# EAGLE design open-circuit (EAGLE 6.6.0)
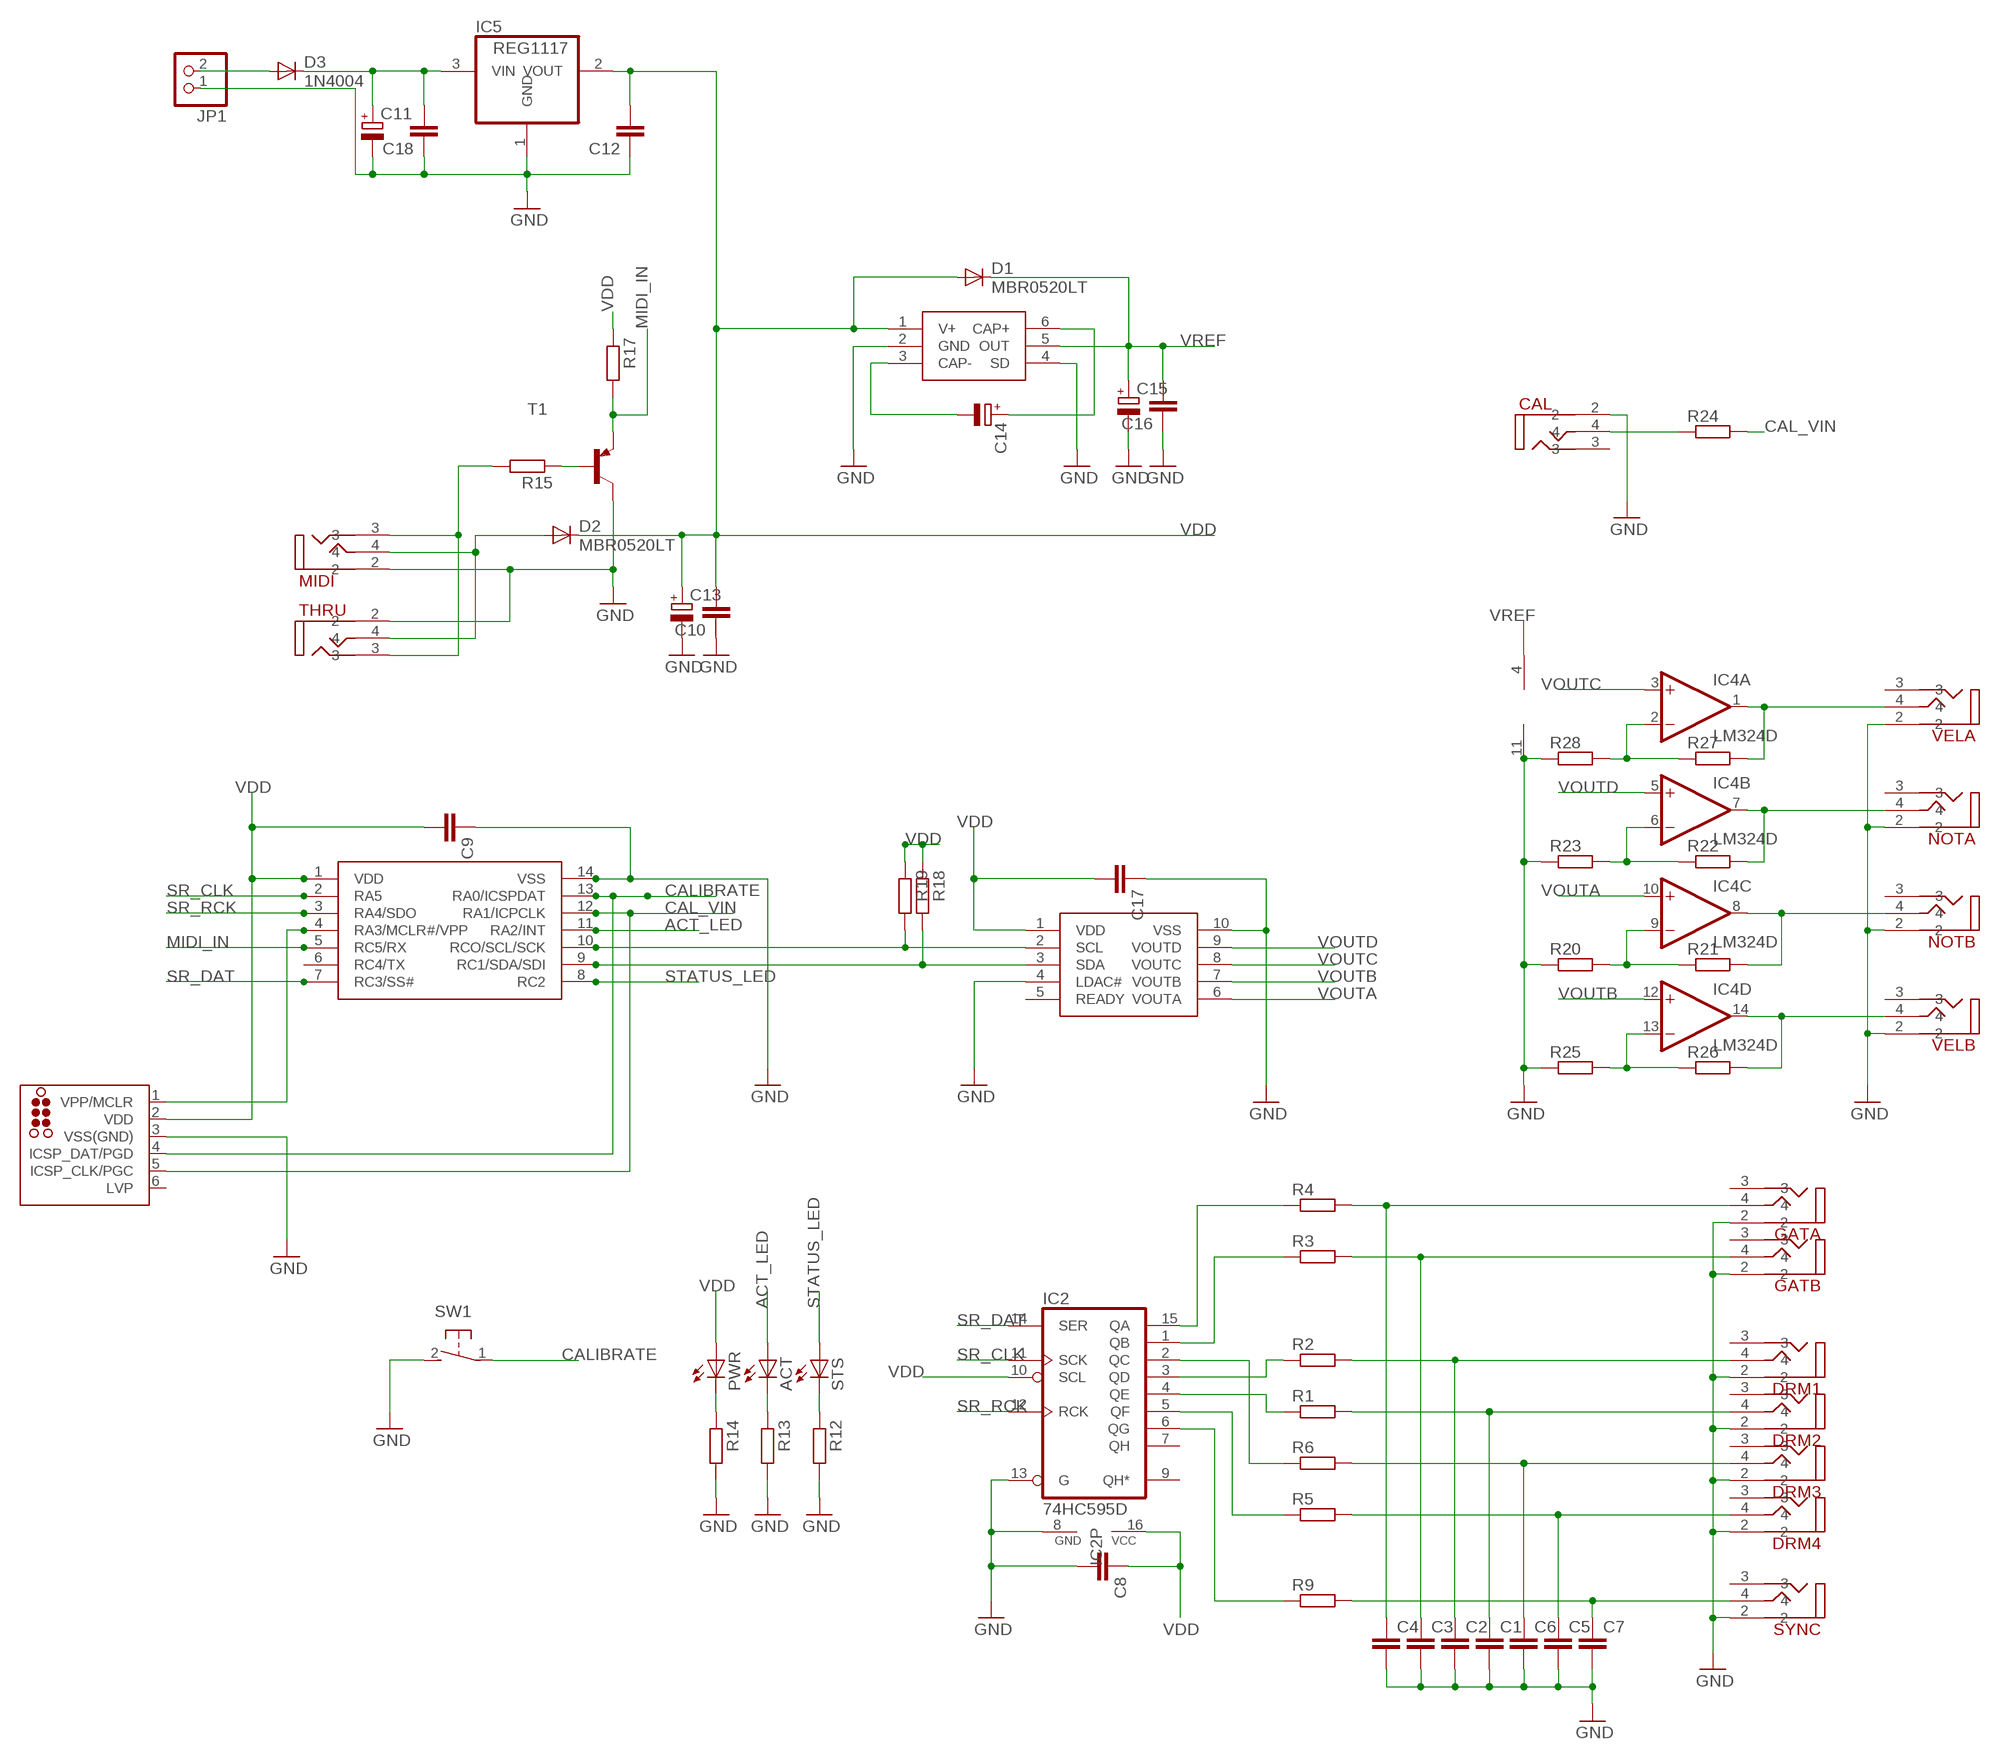
[diagram p0: schematic, sheet 1]

## Parts
ACT  LED3MM  [LED3MM]
C1  C-EUC0805  [C0805]
C2  C-EUC0805  [C0805]
C3  C-EUC0805  [C0805]
C4  C-EUC0805  [C0805]
C5  C-EUC0805  [C0805]
C6  C-EUC0805  [C0805]
C7  C-EUC0805  [C0805]
C8  C-EUC0805  [C0805]
C9  C-EUC0805  [C0805]
C10  C-EUC0805  [C0805]
C11  CPOL-EUE2.5-5  [E2,5-5]
C12  C-EUC0805  [C0805]
C13  CPOL-EUSMCA  [SMC_A]
C14  CPOL-EUSMCA  [SMC_A]
C15  CPOL-EUSMCA  [SMC_A]
C16  C-EUC0805  [C0805]
C17  C-EUC0805  [C0805]
C18  C-EUC0805  [C0805]
CAL  VERTICAL_3_5MM_SOCKET  [VERTICAL_3_5MM_SOCKET]
D1  MBR0520LT  [SOD123]
D2  MBR0520LT  [SOD123]
D3  1N4004  [DO-VERT]
DRM1  VERTICAL_3_5MM_SOCKET  [VERTICAL_3_5MM_SOCKET]
DRM2  VERTICAL_3_5MM_SOCKET  [VERTICAL_3_5MM_SOCKET]
DRM3  VERTICAL_3_5MM_SOCKET  [VERTICAL_3_5MM_SOCKET]
DRM4  VERTICAL_3_5MM_SOCKET  [VERTICAL_3_5MM_SOCKET]
GATA  VERTICAL_3_5MM_SOCKET  [VERTICAL_3_5MM_SOCKET]
GATB  VERTICAL_3_5MM_SOCKET  [VERTICAL_3_5MM_SOCKET]
IC1  PIC16F1825SO14  [SO14]
IC2  74HC595D  [SO16]
IC3  MCP4728_QUAD_DAC  [MSOP10]
IC4  LM324D  [SO14]
IC5  REG1117  [SOT223]
IC6  LM27675M5_CHARGEPUMP  [SOT23-6]
ISCP  TC2030-MCP-NL  [TC2030-MCP-NL]
JP1  PINHD-1X2  [1X02]
MIDI  VERTICAL_3_5MM_SOCKET  [VERTICAL_3_5MM_SOCKET]
NOTA  VERTICAL_3_5MM_SOCKET  [VERTICAL_3_5MM_SOCKET]
NOTB  VERTICAL_3_5MM_SOCKET  [VERTICAL_3_5MM_SOCKET]
PWR  LED3MM  [LED3MM]
R1  R-EU_R0805  [R0805]
R2  R-EU_R0805  [R0805]
R3  R-EU_R0805  [R0805]
R4  R-EU_R0805  [R0805]
R5  R-EU_R0805  [R0805]
R6  R-EU_R0805  [R0805]
R9  R-EU_R0805  [R0805]
R12  R-EU_R0805  [R0805]
R13  R-EU_R0805  [R0805]
R14  R-EU_R0805  [R0805]
R15  R-EU_R0805  [R0805]
R17  R-EU_R0805  [R0805]
R18  R-EU_R0805  [R0805]
R19  R-EU_R0805  [R0805]
R20  R-EU_R0805  [R0805]
R21  R-EU_R0805  [R0805]
R22  R-EU_R0805  [R0805]
R23  R-EU_R0805  [R0805]
R24  R-EU_R0805  [R0805]
R25  R-EU_R0805  [R0805]
R26  R-EU_R0805  [R0805]
R27  R-EU_R0805  [R0805]
R28  R-EU_R0805  [R0805]
STS  LED3MM  [LED3MM]
SW1  31-XX  [B3F-31XX]
SYNC  VERTICAL_3_5MM_SOCKET  [VERTICAL_3_5MM_SOCKET]
T1  MMBT3906LT1-PNP-SOT23-BEC  [SOT23-BEC]
THRU  VERTICAL_3_5MM_SOCKET  [VERTICAL_3_5MM_SOCKET]
VELA  VERTICAL_3_5MM_SOCKET  [VERTICAL_3_5MM_SOCKET]
VELB  VERTICAL_3_5MM_SOCKET  [VERTICAL_3_5MM_SOCKET]

## Nets
ACT_LED: ACT.A IC1.11(RA2/INT)
CAL_VIN: IC1.12(RA1/ICPCLK) ISCP.5(ICSP_CLK/PGC) R24.2
CALIBRATE: IC1.13(RA0/ICSPDAT) ISCP.4(ICSP_DAT/PGD) SW1.1(P)
GND: C1.2 C2.2 C3.2 C4.2 C5.2 C6.2 C7.2 C8.2 C9.1 C10.1 C11.- C12.1 C13.- C15.- C16.1 C17.1 C18.1 CAL.2 DRM1.2 DRM2.2 DRM3.2 DRM4.2 GATA.2 GATB.2 IC1.14(VSS) IC2.8(GND) IC2.13(G) IC3.4(LDAC#) IC3.10(VSS) IC4.11(P:V-) IC5.1(GND) IC6.2(GND) IC6.4(SD) ISCP.3(VSS(GND)) JP1.1 MIDI.2 NOTA.2 NOTB.2 R12.2 R13.2 R14.2 R20.1 R23.1 R25.1 R28.1 SW1.2(S) SYNC.2 T1.C THRU.2 VELA.2 VELB.2
MIDI_IN: IC1.5(RC5/RX) R17.2 T1.E
N$1: C4.1 GATA.4 R4.2
N$2: IC4.1(A:OUT) R27.2 VELA.4
N$3: IC4.7(B:OUT) NOTA.4 R22.2
N$4: IC4.8(C:OUT) NOTB.4 R21.2
N$5: IC4.14(D:OUT) R26.2 VELB.4
N$6: C3.1 GATB.4 R3.2
N$7: C2.1 DRM1.4 R2.2
N$8: C1.1 DRM2.4 R1.2
N$9: C6.1 DRM3.4 R6.2
N$10: C5.1 DRM4.4 R5.2
N$11: C7.1 R9.2 SYNC.4
N$12: IC2.15(QA) R4.1
N$13: IC2.1(QB) R3.1
N$14: R15.1 T1.B
N$15: IC2.4(QE) R1.1
N$16: IC2.3(QD) R2.1
N$17: IC2.5(QF) R5.1
N$18: IC2.6(QG) R9.1
N$19: C11.+ C18.2 D3.C IC5.3(VIN)
N$20: MIDI.3 R15.2 THRU.3
N$21: IC1.10(RCO/SCL/SCK) IC3.2(SCL) R19.2
N$22: IC1.9(RC1/SDA/SDI) IC3.3(SDA) R18.2
N$23: C14.- IC6.3(CAP-)
N$24: C14.+ IC6.6(CAP+)
N$25: IC4.2(A:-IN) R27.1 R28.2
N$26: IC4.6(B:-IN) R22.1 R23.2
N$27: IC4.9(C:-IN) R20.2 R21.1
N$28: IC4.13(D:-IN) R25.2 R26.1
N$33: CAL.4 R24.1
N$34: IC1.4(RA3/MCLR#/VPP) ISCP.1(VPP/MCLR)
N$35: PWR.K(C) R14.1
N$36: ACT.K(C) R13.1
N$37: R12.1 STS.K(C)
N$38: IC2.2(QC) R6.1
N$39: D2.A MIDI.4 THRU.4
N$40: D3.A JP1.2
SR_CLK: IC1.2(RA5) IC2.11(SCK)
SR_DAT: IC1.7(RC3/SS#) IC2.14(SER)
SR_RCK: IC1.3(RA4/SDO) IC2.12(RCK)
STATUS_LED: IC1.8(RC2) STS.A
VDD: C8.1 C9.2 C10.2 C12.2 C13.+ C17.2 D1.A D2.C IC1.1(VDD) IC2.10(SCL) IC2.16(VCC) IC3.1(VDD) IC5.2(VOUT) IC6.1(V+) ISCP.2(VDD) PWR.A R17.1 R18.1 R19.1
VOUTA: IC3.6(VOUTA) IC4.10(C:+IN)
VOUTB: IC3.7(VOUTB) IC4.12(D:+IN)
VOUTC: IC3.8(VOUTC) IC4.3(A:+IN)
VOUTD: IC3.9(VOUTD) IC4.5(B:+IN)
VREF: C15.+ C16.2 D1.C IC4.4(P:V+) IC6.5(OUT)
Unconnected: CAL.3 DRM1.3 DRM2.3 DRM3.3 DRM4.3 GATA.3 GATB.3 IC1.6(RC4/TX) IC2.7(QH) IC2.9(QH*) IC3.5(READY) ISCP.6(LVP) NOTA.3 NOTB.3 SYNC.3 VELA.3 VELB.3

## Library data of the parts
ACT PWR STS = led:LED: LED OSRAM: - CHIPLED LG R971, LG N971, LY N971, LG Q971, LY Q971, LO R971, LY R971 LH N974, LH R974 LS Q976, LO Q976, LY Q976 LO Q996 - Hyper CHIPLED LW Q18S LB Q993, LB Q99A, LB R99A - SideLED LS A670, LO A670, LY A670, LG A670, LP A670 LB A673, LV A673, LT A673, LW A673 LH A674 LY A675 LS A676, LA A676, LO A676, LY A676, LW A676 LS A679, LY A679, LG A679 - Hyper Micro SIDELED® LS Y876, LA Y876, LO Y876, LY Y876 LT Y87S - SmartLED LW L88C, LW L88S LB L89C, LB L89S, LG L890 LS L89K, LO L89K, LY L89K LS L896, LA L896, LO L896, LY L896 - TOPLED LS T670, LO T670, LY T670, LG T670, LP T670 LSG T670, LSP T670, LSY T670, LOP T670, LYG T670 LG T671, LOG T671, LSG T671 LB T673, LV T673, LT T673, LW T673 LH T674 LS T676, LA T676, LO T676, LY T676, LB T676, LH T676, LSB T676, LW T676 LB T67C, LV T67C, LT T67C, LS T67K, LO T67K, LY T67K, LW E67C LS E67B, LA E67B, LO E67B, LY E67B, LB E67C, LV E67C, LT E67C LW T67C LS T679, LY T679, LG T679 LS T770, LO T770, LY T770, LG T770, LP T770 LB T773, LV T773, LT T773, LW T773 LH T774 LS E675, LA E675, LY E675, LS T675 LS T776, LA T776, LO T776, LY T776, LB T776 LHGB T686 LT T68C, LB T68C - Hyper Mini TOPLED® LB M676 - Mini TOPLED Santana® LG M470 LS M47K, LO M47K, LY M47K Source: http://www.osram.convergy.de LUXEON: - LUMILED® LXK2-PW12-R00, LXK2-PW12-S00, LXK2-PW14-U00, LXK2-PW14-V00 LXK2-PM12-R00, LXK2-PM12-S00, LXK2-PM14-U00 LXK2-PE12-Q00, LXK2-PE12-R00, LXK2-PE12-S00, LXK2-PE14-T00, LXK2-PE14-U00 LXK2-PB12-K00, LXK2-PB12-L00, LXK2-PB12-M00, LXK2-PB14-N00, LXK2-PB14-P00, LXK2-PB14-Q00 LXK2-PR12-L00, LXK2-PR12-M00, LXK2-PR14-Q00, LXK2-PR14-R00 LXK2-PD12-Q00, LXK2-PD12-R00, LXK2-PD12-S00 LXK2-PH12-R00, LXK2-PH12-S00 LXK2-PL12-P00, LXK2-PL12-Q00, LXK2-PL12-R00 Source: www.luxeon.com KINGBRIGHT: KA-3528ASYC Source: www.kingbright.com
C1-C10 C12 C16-C18 = rcl:C-EU: CAPACITOR, European symbol
C11 = resistor:CPOL-EU: POLARIZED CAPACITOR, European symbol
C13-C15 = rcl:CPOL-EU: POLARIZED CAPACITOR, European symbol
CAL DRM1-DRM4 GATA GATB MIDI NOTA NOTB SYNC THRU VELA VELB = jason_eagle6:VERTICAL_3_5MM_SOCKET
D1 D2 = diode:MBR0520LT: SCHOTTKY BARRIER RECTIFIER Source: http://onsemi.com .. MBR0520LT1-D.pdf
D3 = jasons_stuff:1N4004: DIODE general purpose rectifier, 1 A
IC1 = jasons_stuff:PIC16F1825
IC2 = 74xx-eu:74*595: 8-bit SHIFT REGISTER, output latch
IC3 = jason_eagle6:MCP4728_QUAD_DAC
IC4 = linear:LM324: OP AMP
IC5 = burr-brown:REG1117: 800mA and 1A Low Dropout (LDO) Positive Regulator 1.8V, 2.5V, 2.85V, 3.3V, 5V, and Adj; MPN: REG1117; OC_FARNELL: 1097566; OC_NEWARK: 14P6981
IC6 = jason_eagle6:LM27675M5_CHARGEPUMP
ISCP = tag-connect:TC2030: TAG-CONNECT ICSP Connector Manufacturer: Tag-Connect <http://www.tag-connect.com> Cable for easy In-Circuit Serial Programming. Designed for Microchip ICD2, suitable for many others. Two variants - one "with legs" (for hands-free fit on PCB) and another "without legs" for quick programming. PAD Description 1 MCLR/Vpp 2 Vdd 3 GND 4 PGD (ISPDAT) 5 PGC (ISPCLK) 6 nc (used for LVP) ©2009 ROFA.cz - modified and updated by Robert Darlington ‹rdarlington@gmail.com›
JP1 = pinhead:PINHD-1X2: PIN HEADER
R1-R6 R9 R12-R15 R17-R28 = rcl:R-EU_: RESISTOR, European symbol
SW1 = switch-omron:31-XX: OMRON SWITCH; MPN: B3F-3100; OC_FARNELL: 959704; OC_NEWARK: 36M3582
T1 = transistor:*-PNP-: PNP Transistror

## Board
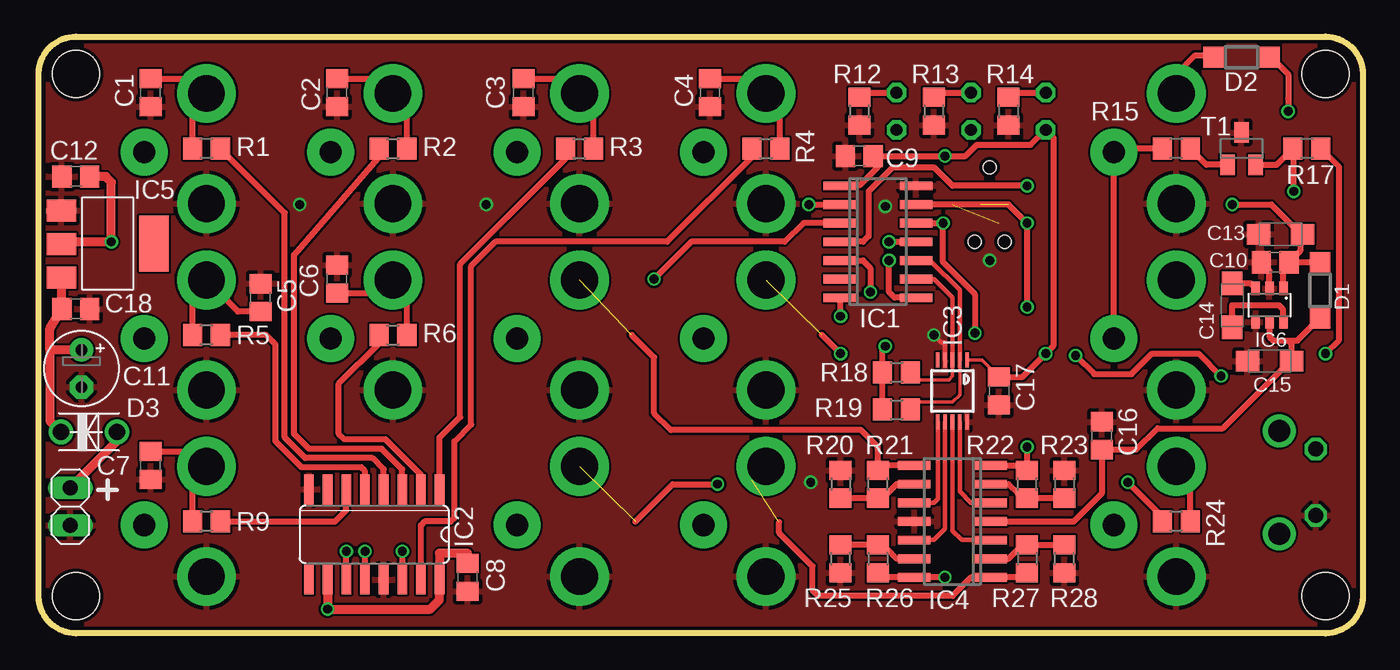
[diagram p1: board, top side]
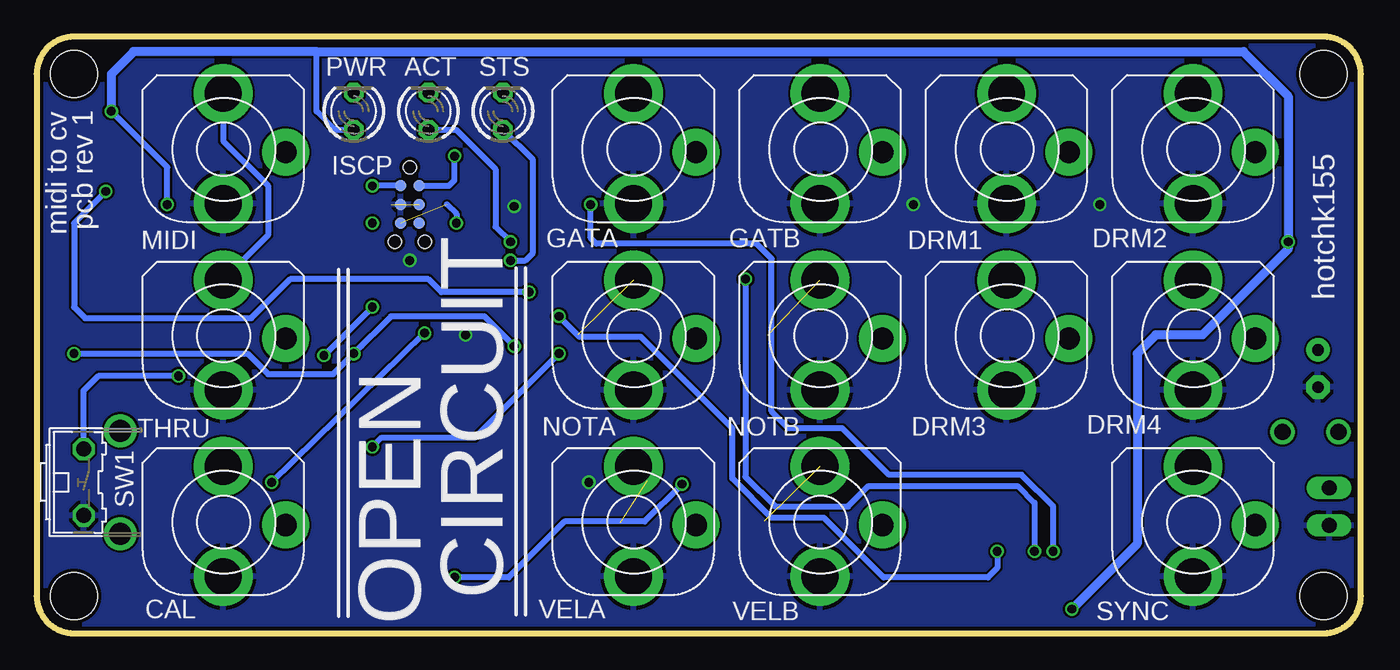
[diagram p2: board, bottom side, seen from below]

Size 90.17 x 40.64 mm. Coordinates in mm from the lower left corner, seen from the top.
Outline: 0,38.1 arc-90 2.54,40.64 87.63,40.64 arc-90 90.17,38.1 90.17,2.54 arc-90 87.63,0 2.54,0 arc-90 0,2.54 0,38.1
Copper layers (1*16): Top 0.035mm / dielectric 1.5mm / Bottom 0.035mm
Design rules "ITEADstudio_DRC": minimum track width 6mil, minimum drill 12mil, track to track 6mil, track to pad 6mil, pad to pad 6mil, via to via 6mil, smd to smd 0mil, copper to edge 10mil, drill to drill 10mil, minimum pad ring 10mil, minimum via ring 6mil, stop-mask expansion 2mil, vias tented up to drill 100mil, thermal gap 10mil
Holes 3.2 mm at 2.54,2.54 2.54,38.1 87.63,2.54 87.63,38.1

### Footprints (pad centres in the part's own frame; a part is rotated, then mirrored left to right if it is on the bottom)
LED3MM = drill 0.813 octagon: A -1.27,0; K 1.27,0
C0805 = smd 1.3 x 1.5: 1 -0.95,0; 2 0.95,0
E2,5-5 = drill 0.813 pad 1.6: + -1.27,0 | drill 0.813 pad 1.6 octagon: - 1.27,0
SMC_A = smd 1.6 x 1.4: + -1.5,0; - 1.5,0
VERTICAL_3_5MM_SOCKET = drill 2.5 pad 4: 2 0,-3.75; 4 0,3.75 | drill 1.5 pad 3.2: 3 4.25,-0.25
SOD123 = smd 1.4 x 1.4: A 1.9,0; C -1.9,0
DO-VERT = drill 1.118: A 2.54,0; C -1.27,0
SO14 = smd 0.6 x 2.2: 1 -3.81,-2.6; 2 -2.54,-2.6; 3 -1.27,-2.6; 4 0,-2.6; 5 1.27,-2.6; 6 2.54,-2.6; 7 3.81,-2.6; 8 3.81,2.6; 9 2.54,2.6; 10 1.27,2.6; 11 0,2.6; 12 -1.27,2.6; 13 -2.54,2.6; 14 -3.81,2.6
SO16 = smd 0.66 x 2.032: 1 -4.445,-3.073; 2 -3.175,-3.073; 3 -1.905,-3.073; 4 -0.635,-3.073; 5 0.635,-3.073; 6 1.905,-3.073; 7 3.175,-3.073; 8 4.445,-3.073; 9 4.445,3.073; 10 3.175,3.073; 11 1.905,3.073; 12 0.635,3.073; 13 -0.635,3.073; 14 -1.905,3.073; 15 -3.175,3.073; 16 -4.445,3.073
MSOP10 = smd 0.25 x 1: 1 -1,-2.113; 2 -0.5,-2.113; 3 0,-2.113; 4 0.5,-2.113; 5 1,-2.113; 6 1,2.113; 7 0.5,2.113; 8 0,2.113; 9 -0.5,2.113; 10 -1,2.113
SOT223 = smd 1.499 x 2.007: 1 -2.261,-3.15; 2 0.025,-3.15; 3 2.311,-3.15 | smd 3.81 x 2.007: 4 0,3.15
SOT23-6 = smd 0.6 x 0.9: 1 -0.95,-1.15; 2 0,-1.15; 3 0.95,-1.15; 4 0.95,1.15; 5 0,1.15; 6 -0.95,1.15
TC2030-MCP-NL = smd 0.787 x 0.787: 1 1.27,-0.635; 2 1.27,0.635; 3 2.54,-0.635; 4 2.54,0.635; 5 3.81,-0.635; 6 3.81,0.635 | hole 0.889: 0,0; 5.08,-1.016; 5.08,1.016
1X02 = drill 1.016 long: 1 -1.27,0; 2 1.27,0
R0805 = smd 1.3 x 1.5: 1 -0.95,0; 2 0.95,0
B3F-31XX = drill 1.016 octagon: 1 -2.261,-1.245; 2 2.261,-1.245 | drill 1.499 pad 2.159: 3 -3.505,1.245; 4 3.505,1.245
SOT23-BEC = smd 1 x 1.4: B -0.95,-1.1; C 0,1.1; E 0.95,-1.1

### Placement (x,y rotation side)
ACT  63.5,35.56 90 bottom
C1  7.62,36.83 270 top
C2  20.32,36.83 270 top
C3  33.02,36.83 270 top
C4  45.72,36.83 270 top
C5  15.11,22.86 90 top
C6  20.32,24.13 90 top
C7  7.62,11.43 270 top
C8  29.21,3.81 270 top
C9  55.88,32.51 0 top
C10  84.2,25.27 0 top
C11  2.92,18.03 270 top
C12  2.54,31.11 0 top
C13  84.58,27.18 180 top
C14  81.28,22.35 90 top
C15  83.82,18.54 180 top
C16  72.39,13.46 270 top
C17  65.41,16.51 90 top
C18  2.54,22.1 180 top
CAL  77.47,7.62 0 bottom
D1  87.25,23.37 90 top
D2  81.91,39.24 180 top
D3  2.79,13.72 0 top
DRM1  24.13,33.02 0 bottom
DRM2  11.43,33.02 0 bottom
DRM3  24.13,20.32 0 bottom
DRM4  11.43,20.32 0 bottom
GATA  49.53,33.02 0 bottom
GATB  36.83,33.02 0 bottom
IC1  57.15,26.67 270 top
IC2  22.86,6.73 180 top
IC3  62.23,16.51 180 top
IC4  62.23,7.62 90 top
IC5  4.7,26.54 270 top
IC6  83.82,22.35 180 top
ISCP  64.77,31.75 270 bottom
JP1  2.16,8.64 90 top
MIDI  77.47,33.02 0 bottom
NOTA  49.53,20.32 0 bottom
NOTB  36.83,20.32 0 bottom
PWR  68.58,35.56 90 bottom
R1  11.43,33.02 180 top
R2  24.13,33.02 0 top
R3  36.83,33.02 0 top
R4  49.53,33.02 0 top
R5  11.43,20.32 180 top
R6  24.13,20.32 0 top
R9  11.43,7.62 180 top
R12  55.88,35.56 270 top
R13  60.96,35.56 270 top
R14  66.04,35.56 270 top
R15  77.47,33.02 180 top
R17  86.36,33.02 180 top
R18  58.42,17.78 0 top
R19  58.42,15.24 0 top
R20  54.61,10.16 270 top
R21  57.15,10.16 90 top
R22  67.31,10.16 90 top
R23  69.85,10.16 270 top
R24  77.47,7.62 180 top
R25  54.61,5.08 90 top
R26  57.15,5.08 270 top
R27  67.31,5.08 270 top
R28  69.85,5.08 90 top
STS  58.42,35.56 90 bottom
SW1  85.72,10.29 270 bottom
SYNC  11.43,7.62 0 bottom
T1  81.91,33.02 0 top
THRU  77.47,20.32 0 bottom
VELA  49.53,7.62 0 bottom
VELB  36.83,7.62 0 bottom

### Tracks (layer width: path | path; a pad name or v marks a point on that pad's centre or on a via)
ACT_LED  (via drill 0.6)
  Top 0.406: v57.91,26.67 IC1.11
  Bottom 0.406: v57.91,26.67 58.93,27.69 58.93,31.62 61.59,34.29 ACT.A
CAL_VIN  (via drill 0.6)  (1 unrouted)
  Top 0.406: R24.2 76.52,7.93 v74.17,10.29 | IC1.12 v61.59,27.94 61.59,25.27 63.75,23.11 v63.75,20.45
  Bottom 0.406: v74.17,10.29 v63.75,20.45 | 62.23,29.21 61.59,28.58 v61.59,27.94
CALIBRATE  (via drill 0.6)  (1 unrouted)
  Top 0.406: v67.31,22.22 v67.31,27.94 66.04,29.21 IC1.13 | v70.61,18.92 71.88,17.65 74.42,17.65 75.82,19.05 78.99,19.05 v80.52,17.53
  Bottom 0.406: v67.31,22.22 v70.61,18.92 | v80.52,17.53 85.98,17.53 87,16.51 87,13.84 86.97,13.82 SW1.1
GND  (via drill 0.6)
  Top 0.305: IC3.4 61.73,19.8 61.72,19.81 61.47,19.81 v60.96,20.32
  Top 0.406: IC6.2 83.82,24.7 C10.1
  other vias: 57.66,29.08 30.48,29.21 17.78,29.21 64.77,25.4 52.58,10.29
  pour Top: -1.27,41.91 -1.27,-1.27 100.33,-1.27 100.33,43.18 0,43.18
  pour Bottom: -2.54,40.64 -2.54,-2.54 93.98,-2.54 93.98,44.45 -2.54,44.45
MIDI_IN  (via drill 0.6)
  Top 0.406: IC1.5 56.13,25.4 56.64,24.89 v56.64,23.24 | T1.E 84.31,31.92 R17.2 85.47,32.96 v85.47,30.1
  Bottom 0.406: v85.47,30.1 87.63,27.94 87.63,22.22 86.87,21.46 75.56,21.46 72.9,24.13 63.5,24.13 62.61,23.24 v56.64,23.24
N$1
  Top 0.406: R4.2 50.48,35.82 GATA.4 48.52,37.78 C4.1
N$2  (1 unrouted)
  Top 0.406: R27.2 66.99,3.81 IC4.1 63.5,3.81 62.23,2.54 53.09,2.54 52.7,2.92 52.7,4.57 50.42,6.86 50.42,7.56 | 48.58,10.42 VELA.4
N$3  (via drill 0.6)  (1 unrouted)
  Top 0.406: IC4.7 66.99,11.43 R22.2 v67.31,12.7 | 53.34,20.32 53.97,19.69 v54.61,19.05 | 48.58,23.12 NOTA.4
  Bottom 0.406: v67.31,12.7 66.67,13.33 60.33,13.33 v54.61,19.05
N$4  (1 unrouted)
  Top 0.406: IC4.8 57.47,11.43 R21.2 57.15,12.7 56.01,13.84 43.05,13.84 41.91,14.99 41.91,18.8 40.39,20.32 | 35.88,23.12 NOTB.4
N$5  (via drill 0.6)  (1 unrouted)
  Top 0.406: R26.2 57.47,3.81 IC4.14 v61.72,3.81 | 40.64,7.62 43.18,10.16 v46.23,10.16 | 35.88,10.42 VELB.4
  Bottom 0.406: v61.72,3.81 58.04,3.81 54.23,7.62 48.77,7.62 v46.23,10.16
N$6
  Top 0.406: R3.2 37.78,35.82 GATB.4 35.82,37.78 C3.1
N$7
  Top 0.406: C2.1 23.12,37.78 23.46,37.44 DRM1.4 25.08,35.82 R2.2
N$8
  Top 0.406: R1.2 10.48,35.82 DRM2.4 10.42,37.78 C1.1
N$9
  Top 0.406: R6.2 25.08,23.12 DRM3.4 23.24,23.18 C6.1
N$10
  Top 0.406: C5.1 13.59,21.91 DRM4.4 10.48,23.12 R5.2
N$11
  Top 0.406: C7.1 10.42,12.38 SYNC.4 10.48,10.42 R9.2
N$12
  Top 0.406: IC2.15 26.04,7.37 26.29,7.62 28.07,7.62 28.32,7.87 28.32,13.08 29.46,14.22 29.46,25.02 31.11,26.67 42.8,26.67 48.58,32.45 R4.1
N$13
  Top 0.406: IC2.1 27.3,13.33 28.7,14.73 28.7,25.15 35.88,32.32 R3.1
N$14
  Top 0.406: T1.B 79.52,31.92 R15.1
N$15
  Top 0.406: R1.1 16.76,28.64 16.76,13.33 18.16,11.94 22.73,11.94 23.5,11.18 IC2.4
N$16
  Top 0.406: R2.1 23.11,32.95 23.11,32.38 17.4,25.78 17.4,13.59 18.42,12.57 23.37,12.57 24.77,11.18 IC2.3
N$17
  Top 0.406: R5.1 15.49,20.32 16.13,19.69 16.13,13.08 17.91,11.3 21.97,11.3 22.23,11.05 IC2.5
N$18
  Top 0.406: R9.1 20.19,7.62 20.96,8.38 IC2.6 20.96,9.52
N$19
  Top 0.61: 0.76,19.3 0.76,14.48 D3.C | 0.76,19.3 0.76,20.76 C18.2 1.59,24.19 IC5.3 | C11.+ 0.76,19.3
N$20
  Top 0.406: R15.2 73.66,33.02 | 73.66,33.02 73.47,33.02 MIDI.3 | THRU.3 73.22,32.58 73.66,33.02
N$21
  Top 0.254: IC3.2 62.73,16.25 62.23,15.75 59.88,15.75 R19.2
  Top 0.305: IC3.2 62.73,23.38 60.71,25.4 IC1.10
N$22
  Top 0.254: IC3.3 62.23,17.53 61.98,17.27 59.88,17.27 R18.2
  Top 0.305: IC3.3 62.23,22.86 60.96,24.13 IC1.9
N$23
  Top 0.406: C14.- 82.52,23.85 IC6.3
N$24
  Top 0.406: C14.+ 81.28,22.35 84.45,22.35 84.71,22.1 84.71,21.26 IC6.6
N$25
  Top 0.406: IC4.2 66.04,5.08 66.67,5.71 67,5.71 R27.1 R28.2
N$26
  Top 0.406: IC4.6 66.04,10.16 66.67,9.52 67,9.52 R22.1 R23.2
N$27
  Top 0.406: IC4.9 58.42,10.16 57.78,9.52 57.46,9.52 R21.1 R20.2
N$28
  Top 0.406: IC4.13 58.42,5.08 57.78,5.71 57.46,5.71 R26.1 R25.2
N$33
  Top 0.406: R24.1 78.42,10.42 CAL.4
N$34  (via drill 0.6)
  Top 0.406: v67.31,30.48 62.23,30.48 60.96,31.75 58.17,31.75 56.52,30.1 56.52,27.05 56.13,26.67 IC1.4
  Bottom 0.406: ISCP.1 v67.31,30.48
N$35
  Top 0.406: R14.1 66.36,36.83 PWR.K
N$36
  Top 0.406: R13.1 61.28,36.83 ACT.K
N$37
  Top 0.406: R12.1 56.2,36.83 STS.K
N$38
  Top 0.406: IC2.2 26.04,10.79 23.62,13.21 20.83,13.21 20.45,13.59 20.45,17.02 23.18,19.75 R6.1
N$39
  Top 0.406: 77.53,36.83 MIDI.4 77.47,38.1 78.74,39.37 79.89,39.37 D2.A
  Bottom 0.406: 77.53,36.77 MIDI.4 77.47,33.53 74.42,30.48 74.42,27.12 THRU.4
N$40
  Top 0.61: D3.A 5.33,13.08 JP1.2
SR_CLK  (via drill 0.6)
  Top 0.406: IC2.11 v20.96,5.59 | v52.45,29.21 IC1.2
  Bottom 0.406: v20.96,5.59 20.96,8.64 23.11,10.79 32.13,10.79 35.31,13.97 38.99,13.97 40.13,15.11 40.13,25.53 41.15,26.54 52.07,26.54 52.45,26.92 v52.45,29.21
SR_DAT  (via drill 0.6)
  Top 0.406: v24.77,5.59 IC2.14 | v54.61,21.59 54.61,22.8 IC1.7
  Bottom 0.406: v54.61,21.59 53.21,20.19 49.02,20.19 42.8,13.97 42.8,10.54 40.13,7.87 36.58,7.87 32.51,3.81 25.4,3.81 24.77,4.45 v24.77,5.59
SR_RCK  (via drill 0.6)
  Top 0.406: IC1.3 52.07,27.94 50.8,26.67 44.45,26.67 v41.91,24.13 | IC2.12 v22.23,5.59
  Bottom 0.406: v41.91,24.13 41.91,10.67 39.88,8.64 34.92,8.64 33.53,10.03 23.37,10.03 22.23,8.89 v22.23,5.59
STATUS_LED  (via drill 0.6)
  Top 0.406: IC1.8 58.29,22.86 57.91,23.24 v57.91,25.4
  Bottom 0.406: v57.91,25.4 56.9,25.4 56.39,25.91 56.39,32.26 STS.A
VDD  (via drill 0.6)
  Top 0.254: IC3.1 64.24,18.62 C17.2
  Top 0.406: v81.28,29.21 83.95,29.21 85.47,27.69 85.57,27.69 C13.+ 85.91,27.01 85.91,26.03 C10.2 | 85.09,36.45 v85.09,35.56 85.09,38.1 83.95,39.24 D2.C | 27.3,3.81 IC2.16 | R19.1 R18.1 57.47,19.37 v57.66,19.56 | C17.2 66.99,17.46 v68.58,19.05 69.09,19.56 69.09,33.78 PWR.A 67.56,33.27 63.88,33.27 63.12,32.51 v61.72,32.51 C9.2 57.15,32.19 57.15,31.75 55.94,30.54 54.61,30.54 IC1.1 | v87.63,19.05 88.52,19.94 88.52,31.81 R17.1 | IC6.1 84.77,24.89 C10.2 | D1.A C10.2
  Top 0.61: IC5.2 1.7,26.67 v4.95,26.67 4.95,30.73 4.57,31.11 C12.2 | 27.3,3.81 27.3,2.29 26.67,1.65 v19.69,1.65 IC2.10 | C8.1 29.21,5.46 27.3,5.46 IC2.16
  Bottom 0.406: v81.28,29.21 81.28,31.75 v85.09,35.56 | PWR.A 69.85,34.29 71.12,35.56 71.12,39.62 | ISCP.2 62.1,30.48 61.72,30.86 v61.72,32.51 | v87.63,19.05 75.82,19.05 74.42,17.65 69.98,17.65 v68.58,19.05 | 68.07,19.56 v68.58,19.05 | v57.66,19.56 59.69,21.59 66.04,21.59 v68.58,19.05
  Bottom 0.61: v85.09,35.56 85.09,38.1 83.57,39.62 71.12,39.62 8,39.62 4.95,36.58 v4.95,26.67 4.95,26.16 10.79,20.32 13.97,20.32 15.24,19.05 15.24,6.1 v19.69,1.65
VOUTA
  Top 0.305: IC3.6 61.23,9.16 60.96,8.89 IC4.10
VOUTB
  Top 0.305: IC3.7 61.73,7.12 60.96,6.35 IC4.12
VOUTC
  Top 0.305: IC3.8 62.23,6.98 62.86,6.35 IC4.3
VOUTD
  Top 0.305: IC3.9 62.73,9.66 63.5,8.89 IC4.5
VREF
  Top 0.406: 84.84,18.8 85.09,18.54 | 85.09,18.54 C15.+ | 85.51,18.73 C15.+ | IC4.4 70.48,7.62 72.39,9.52 C16.2 74.74,12.51 76.2,13.97 80.64,13.97 85.09,18.41 85.09,18.54 | 85.34,18.52 C15.+ | D1.C 85.72,19.94 85.09,19.94 | IC6.5 83.82,20.19 84.07,19.94 85.09,19.94 | C15.+ 85.32,19.71 85.09,19.94

### Text on the board
bNames: pcb rev 1 | midi to cv | CIRCUIT | hotchk155 | OPEN